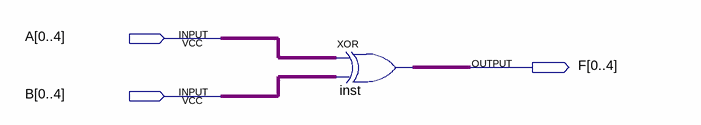
[diagram p0: schematic sheet]
// Quartus schematic porta_xor.bdf as structural Verilog: 1 symbols, 3 pins
module porta_xor (
  input  [0:4] A,
  input  [0:4] B,
  output [0:4] F
);

  assign F = A ^ B;  // XOR inst, 5 bits wide
endmodule
